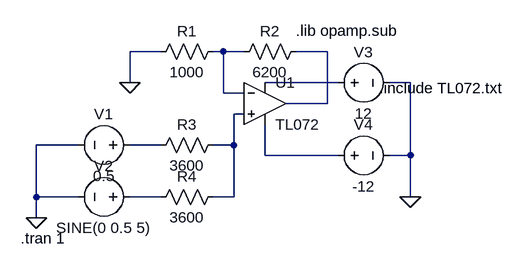
[diagram p0: schematic 1opamp_tl072_implementation.asc]
1opamp_tl072_implementation.asc, the LTspice schematic file:
Version 4
SHEET 1 880 680
WIRE 80 96 32 96
WIRE 176 96 160 96
WIRE 208 96 176 96
WIRE 336 96 288 96
WIRE 32 144 32 96
WIRE 352 144 240 144
WIRE 464 144 432 144
WIRE 176 160 176 96
WIRE 208 160 176 160
WIRE 336 176 336 96
WIRE 336 176 272 176
WIRE 208 192 192 192
WIRE -48 240 -112 240
WIRE 80 240 32 240
WIRE 192 240 192 192
WIRE 192 240 160 240
WIRE 240 256 240 208
WIRE 352 256 240 256
WIRE 464 256 464 144
WIRE 464 256 432 256
WIRE -112 320 -112 240
WIRE -48 320 -112 320
WIRE 80 320 32 320
WIRE 192 320 192 240
WIRE 192 320 160 320
WIRE 464 320 464 256
WIRE -112 352 -112 320
FLAG 32 144 0
FLAG -112 352 0
FLAG 464 320 0
SYMBOL res 176 80 R90
WINDOW 0 0 56 VBottom 2
WINDOW 3 32 56 VTop 2
SYMATTR InstName R1
SYMATTR Value 1000
SYMBOL res 304 80 R90
WINDOW 0 0 56 VBottom 2
WINDOW 3 32 56 VTop 2
SYMATTR InstName R2
SYMATTR Value 6200
SYMBOL res 176 224 R90
WINDOW 0 0 56 VBottom 2
WINDOW 3 32 56 VTop 2
SYMATTR InstName R3
SYMATTR Value 3600
SYMBOL res 176 304 R90
WINDOW 0 0 56 VBottom 2
WINDOW 3 32 56 VTop 2
SYMATTR InstName R4
SYMATTR Value 3600
SYMBOL voltage 48 240 R90
WINDOW 0 -32 56 VBottom 2
WINDOW 3 32 56 VTop 2
WINDOW 123 0 0 Left 0
WINDOW 39 0 0 Left 0
SYMATTR InstName V1
SYMATTR Value 0.5
SYMBOL voltage 48 320 R90
WINDOW 0 -32 56 VBottom 2
WINDOW 3 32 56 VTop 2
WINDOW 123 0 0 Left 0
WINDOW 39 0 0 Left 0
SYMATTR InstName V2
SYMATTR Value SINE(0 0.5 5)
SYMBOL Opamps\\opamp2 240 112 R0
SYMATTR InstName U1
SYMATTR Value TL072
SYMBOL voltage 336 144 R270
WINDOW 0 32 56 VTop 2
WINDOW 3 -32 56 VBottom 2
WINDOW 123 0 0 Left 0
WINDOW 39 0 0 Left 0
SYMATTR InstName V3
SYMATTR Value 12
SYMBOL voltage 336 256 R270
WINDOW 0 32 56 VTop 2
WINDOW 3 -32 56 VBottom 2
WINDOW 123 0 0 Left 0
WINDOW 39 0 0 Left 0
SYMATTR InstName V4
SYMATTR Value -12
TEXT 288 64 Left 2 !.lib opamp.sub
TEXT -136 384 Left 2 !.tran 1
TEXT 416 152 Left 2 !.include TL072.txt

The netlist it stands for:
* 1opamp_tl072_implementation.asc
R1 N001 0 1000
R2 N002 N001 6200
R3 N004 N005 3600
R4 N004 N007 3600
V1 N005 0 0.5
V2 N007 0 SINE(0 0.5 5)
XU1 N004 N001 N003 N006 N002 TL072  ; pins In+ In- V+ V- OUT
V3 N003 0 12
V4 N006 0 -12
.lib opamp.sub
.tran 1
.include TL072.txt
.backanno
.end